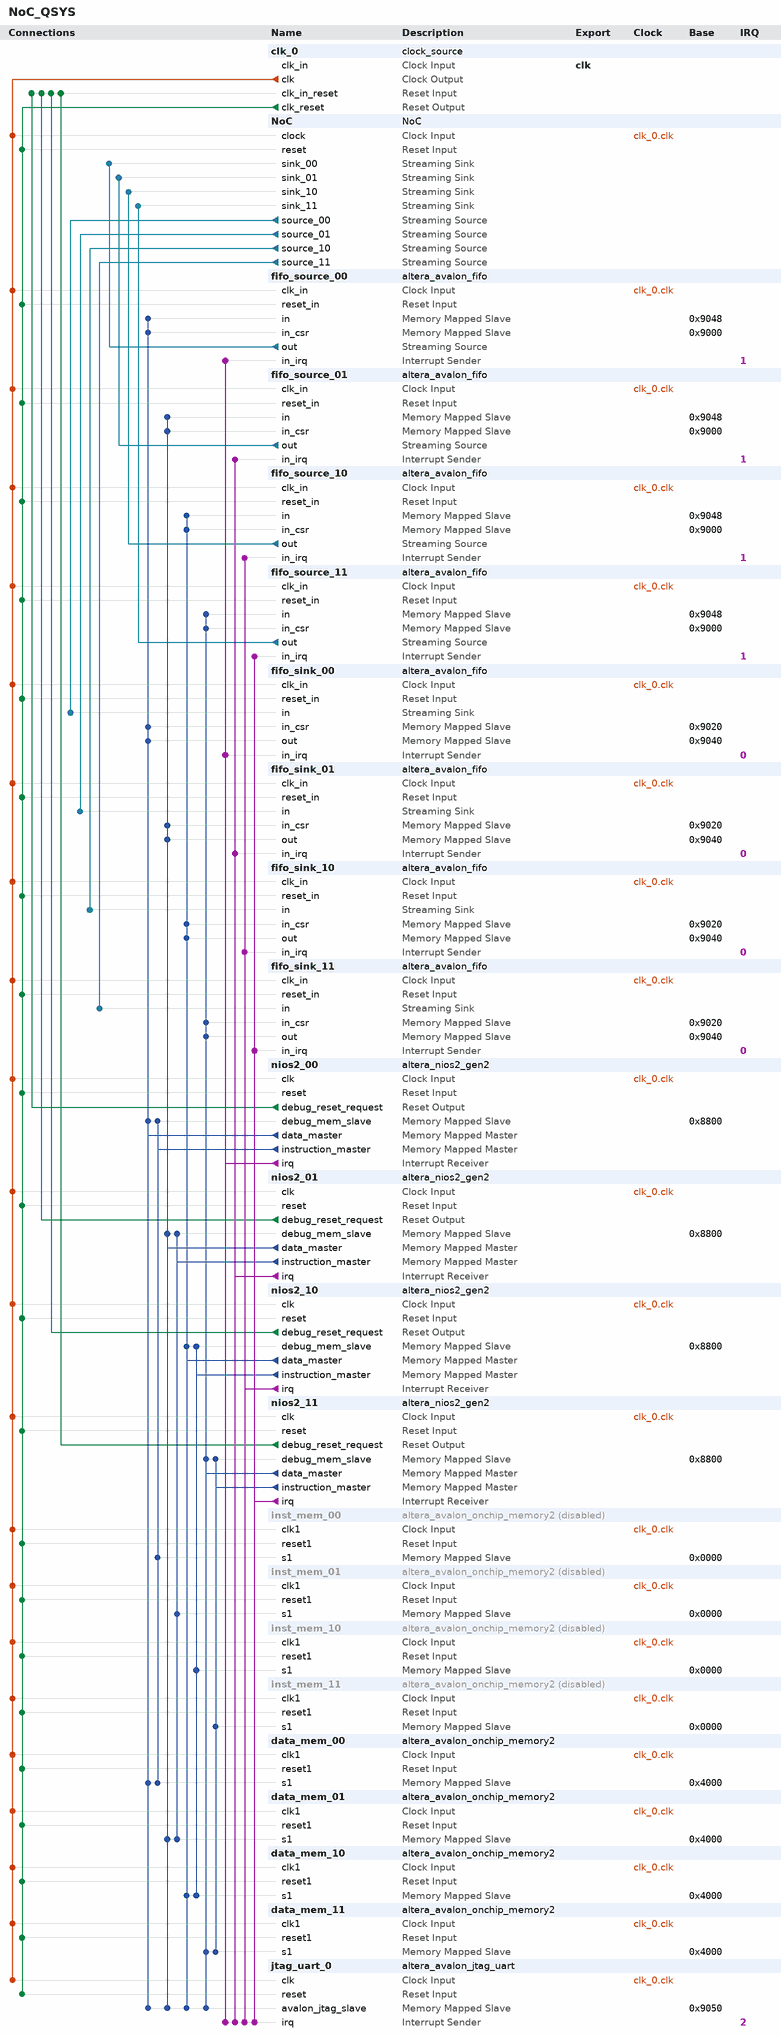
[diagram p0: system contents]
# Platform Designer (Qsys) system NoC_QSYS, Cyclone V 5CSEMA4U23C6
# Parameters at their usual value, and those the tool derives, are not listed.
package require -exact qsys 17.1
create_system NoC_QSYS
set_project_property DEVICE_FAMILY {Cyclone V}
set_project_property DEVICE 5CSEMA4U23C6

add_instance clk_0 clock_source 17.1
set_instance_parameter_value clk_0 clockFrequency 50000000

add_instance NoC NoC 1.0
set_instance_parameter_value NoC DataWidth 8
set_instance_parameter_value NoC PackWidth 8
set_instance_parameter_value NoC PhyCh 4
set_instance_parameter_value NoC PhyChAddr 2
set_instance_parameter_value NoC PhyRoCh 5
set_instance_parameter_value NoC PhyRoChAddr 3
set_instance_parameter_value NoC RoCh 1
set_instance_parameter_value NoC RoChAddr 1
set_instance_parameter_value NoC ViCh 1
set_instance_parameter_value NoC ViChAddr 1

add_instance fifo_source_00 altera_avalon_fifo 17.1
set_instance_parameter_value fifo_source_00 bitsPerSymbol 8
set_instance_parameter_value fifo_source_00 channelWidth 8
set_instance_parameter_value fifo_source_00 errorWidth 8
set_instance_parameter_value fifo_source_00 fifoDepth 16
set_instance_parameter_value fifo_source_00 fifoInputInterfaceOptions AVALONMM_WRITE
set_instance_parameter_value fifo_source_00 fifoOutputInterfaceOptions AVALONST_SOURCE
set_instance_parameter_value fifo_source_00 singleClockMode true
set_instance_parameter_value fifo_source_00 symbolsPerBeat 4
set_instance_parameter_value fifo_source_00 useIRQ true
set_instance_parameter_value fifo_source_00 usePacket false
set_instance_parameter_value fifo_source_00 useReadControl false

add_instance fifo_source_01 altera_avalon_fifo 17.1
set_instance_parameter_value fifo_source_01 bitsPerSymbol 8
set_instance_parameter_value fifo_source_01 channelWidth 8
set_instance_parameter_value fifo_source_01 errorWidth 8
set_instance_parameter_value fifo_source_01 fifoDepth 16
set_instance_parameter_value fifo_source_01 fifoInputInterfaceOptions AVALONMM_WRITE
set_instance_parameter_value fifo_source_01 fifoOutputInterfaceOptions AVALONST_SOURCE
set_instance_parameter_value fifo_source_01 singleClockMode true
set_instance_parameter_value fifo_source_01 symbolsPerBeat 4
set_instance_parameter_value fifo_source_01 useIRQ true
set_instance_parameter_value fifo_source_01 usePacket false
set_instance_parameter_value fifo_source_01 useReadControl false

add_instance fifo_source_10 altera_avalon_fifo 17.1
set_instance_parameter_value fifo_source_10 bitsPerSymbol 8
set_instance_parameter_value fifo_source_10 channelWidth 8
set_instance_parameter_value fifo_source_10 errorWidth 8
set_instance_parameter_value fifo_source_10 fifoDepth 16
set_instance_parameter_value fifo_source_10 fifoInputInterfaceOptions AVALONMM_WRITE
set_instance_parameter_value fifo_source_10 fifoOutputInterfaceOptions AVALONST_SOURCE
set_instance_parameter_value fifo_source_10 singleClockMode true
set_instance_parameter_value fifo_source_10 symbolsPerBeat 4
set_instance_parameter_value fifo_source_10 useIRQ true
set_instance_parameter_value fifo_source_10 usePacket false
set_instance_parameter_value fifo_source_10 useReadControl false

add_instance fifo_source_11 altera_avalon_fifo 17.1
set_instance_parameter_value fifo_source_11 bitsPerSymbol 8
set_instance_parameter_value fifo_source_11 channelWidth 8
set_instance_parameter_value fifo_source_11 errorWidth 8
set_instance_parameter_value fifo_source_11 fifoDepth 16
set_instance_parameter_value fifo_source_11 fifoInputInterfaceOptions AVALONMM_WRITE
set_instance_parameter_value fifo_source_11 fifoOutputInterfaceOptions AVALONST_SOURCE
set_instance_parameter_value fifo_source_11 singleClockMode true
set_instance_parameter_value fifo_source_11 symbolsPerBeat 4
set_instance_parameter_value fifo_source_11 useIRQ true
set_instance_parameter_value fifo_source_11 usePacket false
set_instance_parameter_value fifo_source_11 useReadControl false

add_instance fifo_sink_00 altera_avalon_fifo 17.1
set_instance_parameter_value fifo_sink_00 bitsPerSymbol 8
set_instance_parameter_value fifo_sink_00 channelWidth 8
set_instance_parameter_value fifo_sink_00 errorWidth 8
set_instance_parameter_value fifo_sink_00 fifoDepth 16
set_instance_parameter_value fifo_sink_00 fifoInputInterfaceOptions AVALONST_SINK
set_instance_parameter_value fifo_sink_00 fifoOutputInterfaceOptions AVALONMM_READ
set_instance_parameter_value fifo_sink_00 singleClockMode true
set_instance_parameter_value fifo_sink_00 symbolsPerBeat 4
set_instance_parameter_value fifo_sink_00 useIRQ true
set_instance_parameter_value fifo_sink_00 usePacket false
set_instance_parameter_value fifo_sink_00 useReadControl false

add_instance fifo_sink_01 altera_avalon_fifo 17.1
set_instance_parameter_value fifo_sink_01 bitsPerSymbol 8
set_instance_parameter_value fifo_sink_01 channelWidth 8
set_instance_parameter_value fifo_sink_01 errorWidth 8
set_instance_parameter_value fifo_sink_01 fifoDepth 16
set_instance_parameter_value fifo_sink_01 fifoInputInterfaceOptions AVALONST_SINK
set_instance_parameter_value fifo_sink_01 fifoOutputInterfaceOptions AVALONMM_READ
set_instance_parameter_value fifo_sink_01 singleClockMode true
set_instance_parameter_value fifo_sink_01 symbolsPerBeat 4
set_instance_parameter_value fifo_sink_01 useIRQ true
set_instance_parameter_value fifo_sink_01 usePacket false
set_instance_parameter_value fifo_sink_01 useReadControl false

add_instance fifo_sink_10 altera_avalon_fifo 17.1
set_instance_parameter_value fifo_sink_10 bitsPerSymbol 8
set_instance_parameter_value fifo_sink_10 channelWidth 8
set_instance_parameter_value fifo_sink_10 errorWidth 8
set_instance_parameter_value fifo_sink_10 fifoDepth 16
set_instance_parameter_value fifo_sink_10 fifoInputInterfaceOptions AVALONST_SINK
set_instance_parameter_value fifo_sink_10 fifoOutputInterfaceOptions AVALONMM_READ
set_instance_parameter_value fifo_sink_10 singleClockMode true
set_instance_parameter_value fifo_sink_10 symbolsPerBeat 4
set_instance_parameter_value fifo_sink_10 useIRQ true
set_instance_parameter_value fifo_sink_10 usePacket false
set_instance_parameter_value fifo_sink_10 useReadControl false

add_instance fifo_sink_11 altera_avalon_fifo 17.1
set_instance_parameter_value fifo_sink_11 bitsPerSymbol 8
set_instance_parameter_value fifo_sink_11 channelWidth 8
set_instance_parameter_value fifo_sink_11 errorWidth 8
set_instance_parameter_value fifo_sink_11 fifoDepth 16
set_instance_parameter_value fifo_sink_11 fifoInputInterfaceOptions AVALONST_SINK
set_instance_parameter_value fifo_sink_11 fifoOutputInterfaceOptions AVALONMM_READ
set_instance_parameter_value fifo_sink_11 singleClockMode true
set_instance_parameter_value fifo_sink_11 symbolsPerBeat 4
set_instance_parameter_value fifo_sink_11 useIRQ true
set_instance_parameter_value fifo_sink_11 usePacket false
set_instance_parameter_value fifo_sink_11 useReadControl false

add_instance nios2_00 altera_nios2_gen2 17.1
set_instance_parameter_value nios2_00 dcache_size 2048
set_instance_parameter_value nios2_00 exceptionSlave data_mem_00.s1
set_instance_parameter_value nios2_00 icache_size 4096
set_instance_parameter_value nios2_00 impl Tiny
set_instance_parameter_value nios2_00 resetSlave data_mem_00.s1

add_instance nios2_01 altera_nios2_gen2 17.1
set_instance_parameter_value nios2_01 dcache_size 2048
set_instance_parameter_value nios2_01 exceptionSlave data_mem_01.s1
set_instance_parameter_value nios2_01 icache_size 4096
set_instance_parameter_value nios2_01 impl Tiny
set_instance_parameter_value nios2_01 resetSlave data_mem_01.s1

add_instance nios2_10 altera_nios2_gen2 17.1
set_instance_parameter_value nios2_10 dcache_size 2048
set_instance_parameter_value nios2_10 exceptionSlave data_mem_10.s1
set_instance_parameter_value nios2_10 icache_size 4096
set_instance_parameter_value nios2_10 impl Tiny
set_instance_parameter_value nios2_10 resetSlave data_mem_10.s1

add_instance nios2_11 altera_nios2_gen2 17.1
set_instance_parameter_value nios2_11 dcache_size 2048
set_instance_parameter_value nios2_11 exceptionSlave data_mem_11.s1
set_instance_parameter_value nios2_11 icache_size 4096
set_instance_parameter_value nios2_11 impl Tiny
set_instance_parameter_value nios2_11 resetSlave data_mem_11.s1

add_instance inst_mem_00 altera_avalon_onchip_memory2 17.1
set_instance_property inst_mem_00 ENABLED false
set_instance_parameter_value inst_mem_00 dataWidth 32
set_instance_parameter_value inst_mem_00 dualPort false
set_instance_parameter_value inst_mem_00 initMemContent true
set_instance_parameter_value inst_mem_00 initializationFileName onchip_mem.hex
set_instance_parameter_value inst_mem_00 memorySize 16384

add_instance inst_mem_01 altera_avalon_onchip_memory2 17.1
set_instance_property inst_mem_01 ENABLED false
set_instance_parameter_value inst_mem_01 dataWidth 32
set_instance_parameter_value inst_mem_01 dualPort false
set_instance_parameter_value inst_mem_01 initMemContent true
set_instance_parameter_value inst_mem_01 initializationFileName onchip_mem.hex
set_instance_parameter_value inst_mem_01 memorySize 16384

add_instance inst_mem_10 altera_avalon_onchip_memory2 17.1
set_instance_property inst_mem_10 ENABLED false
set_instance_parameter_value inst_mem_10 dataWidth 32
set_instance_parameter_value inst_mem_10 dualPort false
set_instance_parameter_value inst_mem_10 initMemContent true
set_instance_parameter_value inst_mem_10 initializationFileName onchip_mem.hex
set_instance_parameter_value inst_mem_10 memorySize 16384

add_instance inst_mem_11 altera_avalon_onchip_memory2 17.1
set_instance_property inst_mem_11 ENABLED false
set_instance_parameter_value inst_mem_11 dataWidth 32
set_instance_parameter_value inst_mem_11 dualPort false
set_instance_parameter_value inst_mem_11 initMemContent true
set_instance_parameter_value inst_mem_11 initializationFileName onchip_mem.hex
set_instance_parameter_value inst_mem_11 memorySize 16384

add_instance data_mem_00 altera_avalon_onchip_memory2 17.1
set_instance_parameter_value data_mem_00 dataWidth 32
set_instance_parameter_value data_mem_00 dualPort false
set_instance_parameter_value data_mem_00 initMemContent true
set_instance_parameter_value data_mem_00 initializationFileName onchip_mem.hex
set_instance_parameter_value data_mem_00 memorySize 16384

add_instance data_mem_01 altera_avalon_onchip_memory2 17.1
set_instance_parameter_value data_mem_01 dataWidth 32
set_instance_parameter_value data_mem_01 dualPort false
set_instance_parameter_value data_mem_01 initMemContent true
set_instance_parameter_value data_mem_01 initializationFileName onchip_mem.hex
set_instance_parameter_value data_mem_01 memorySize 16384

add_instance data_mem_10 altera_avalon_onchip_memory2 17.1
set_instance_parameter_value data_mem_10 dataWidth 32
set_instance_parameter_value data_mem_10 dualPort false
set_instance_parameter_value data_mem_10 initMemContent true
set_instance_parameter_value data_mem_10 initializationFileName onchip_mem.hex
set_instance_parameter_value data_mem_10 memorySize 16384

add_instance data_mem_11 altera_avalon_onchip_memory2 17.1
set_instance_parameter_value data_mem_11 dataWidth 32
set_instance_parameter_value data_mem_11 dualPort false
set_instance_parameter_value data_mem_11 initMemContent true
set_instance_parameter_value data_mem_11 initializationFileName onchip_mem.hex
set_instance_parameter_value data_mem_11 memorySize 16384

add_instance jtag_uart_0 altera_avalon_jtag_uart 17.1
set_instance_parameter_value jtag_uart_0 simInteractiveOptions NO_INTERACTIVE_WINDOWS

# connections
add_connection clk_0.clk data_mem_00.clk1 clock
add_connection clk_0.clk data_mem_01.clk1 clock
add_connection clk_0.clk data_mem_10.clk1 clock
add_connection clk_0.clk data_mem_11.clk1 clock
add_connection clk_0.clk fifo_sink_00.clk_in clock
add_connection clk_0.clk fifo_sink_01.clk_in clock
add_connection clk_0.clk fifo_sink_10.clk_in clock
add_connection clk_0.clk fifo_sink_11.clk_in clock
add_connection clk_0.clk fifo_source_00.clk_in clock
add_connection clk_0.clk fifo_source_01.clk_in clock
add_connection clk_0.clk fifo_source_10.clk_in clock
add_connection clk_0.clk fifo_source_11.clk_in clock
add_connection clk_0.clk inst_mem_00.clk1 clock
add_connection clk_0.clk inst_mem_01.clk1 clock
add_connection clk_0.clk inst_mem_10.clk1 clock
add_connection clk_0.clk inst_mem_11.clk1 clock
add_connection clk_0.clk jtag_uart_0.clk clock
add_connection clk_0.clk nios2_00.clk clock
add_connection clk_0.clk nios2_01.clk clock
add_connection clk_0.clk nios2_10.clk clock
add_connection clk_0.clk nios2_11.clk clock
add_connection clk_0.clk NoC.clock clock
add_connection clk_0.clk_reset data_mem_00.reset1 reset
add_connection clk_0.clk_reset data_mem_01.reset1 reset
add_connection clk_0.clk_reset data_mem_10.reset1 reset
add_connection clk_0.clk_reset data_mem_11.reset1 reset
add_connection clk_0.clk_reset fifo_sink_00.reset_in reset
add_connection clk_0.clk_reset fifo_sink_01.reset_in reset
add_connection clk_0.clk_reset fifo_sink_10.reset_in reset
add_connection clk_0.clk_reset fifo_sink_11.reset_in reset
add_connection clk_0.clk_reset fifo_source_00.reset_in reset
add_connection clk_0.clk_reset fifo_source_01.reset_in reset
add_connection clk_0.clk_reset fifo_source_10.reset_in reset
add_connection clk_0.clk_reset fifo_source_11.reset_in reset
add_connection clk_0.clk_reset inst_mem_00.reset1 reset
add_connection clk_0.clk_reset inst_mem_01.reset1 reset
add_connection clk_0.clk_reset inst_mem_10.reset1 reset
add_connection clk_0.clk_reset inst_mem_11.reset1 reset
add_connection clk_0.clk_reset jtag_uart_0.reset reset
add_connection clk_0.clk_reset nios2_00.reset reset
add_connection clk_0.clk_reset nios2_01.reset reset
add_connection clk_0.clk_reset nios2_10.reset reset
add_connection clk_0.clk_reset nios2_11.reset reset
add_connection clk_0.clk_reset NoC.reset reset
add_connection nios2_00.debug_reset_request clk_0.clk_in_reset reset
add_connection nios2_01.debug_reset_request clk_0.clk_in_reset reset
add_connection nios2_10.debug_reset_request clk_0.clk_in_reset reset
add_connection nios2_11.debug_reset_request clk_0.clk_in_reset reset
add_connection nios2_00.data_master data_mem_00.s1 avalon
set_connection_parameter_value nios2_00.data_master/data_mem_00.s1 baseAddress 0x4000
add_connection nios2_00.data_master fifo_sink_00.in_csr avalon
set_connection_parameter_value nios2_00.data_master/fifo_sink_00.in_csr baseAddress 0x9020
add_connection nios2_00.data_master fifo_sink_00.out avalon
set_connection_parameter_value nios2_00.data_master/fifo_sink_00.out baseAddress 0x9040
add_connection nios2_00.data_master fifo_source_00.in avalon
set_connection_parameter_value nios2_00.data_master/fifo_source_00.in baseAddress 0x9048
add_connection nios2_00.data_master fifo_source_00.in_csr avalon
set_connection_parameter_value nios2_00.data_master/fifo_source_00.in_csr baseAddress 0x9000
add_connection nios2_00.data_master jtag_uart_0.avalon_jtag_slave avalon
set_connection_parameter_value nios2_00.data_master/jtag_uart_0.avalon_jtag_slave baseAddress 0x9050
add_connection nios2_00.data_master nios2_00.debug_mem_slave avalon
set_connection_parameter_value nios2_00.data_master/nios2_00.debug_mem_slave baseAddress 0x8800
add_connection nios2_00.instruction_master data_mem_00.s1 avalon
set_connection_parameter_value nios2_00.instruction_master/data_mem_00.s1 baseAddress 0x4000
add_connection nios2_00.instruction_master inst_mem_00.s1 avalon
set_connection_parameter_value nios2_00.instruction_master/inst_mem_00.s1 baseAddress 0x0000
add_connection nios2_00.instruction_master nios2_00.debug_mem_slave avalon
set_connection_parameter_value nios2_00.instruction_master/nios2_00.debug_mem_slave baseAddress 0x8800
add_connection nios2_01.data_master data_mem_01.s1 avalon
set_connection_parameter_value nios2_01.data_master/data_mem_01.s1 baseAddress 0x4000
add_connection nios2_01.data_master fifo_sink_01.in_csr avalon
set_connection_parameter_value nios2_01.data_master/fifo_sink_01.in_csr baseAddress 0x9020
add_connection nios2_01.data_master fifo_sink_01.out avalon
set_connection_parameter_value nios2_01.data_master/fifo_sink_01.out baseAddress 0x9040
add_connection nios2_01.data_master fifo_source_01.in avalon
set_connection_parameter_value nios2_01.data_master/fifo_source_01.in baseAddress 0x9048
add_connection nios2_01.data_master fifo_source_01.in_csr avalon
set_connection_parameter_value nios2_01.data_master/fifo_source_01.in_csr baseAddress 0x9000
add_connection nios2_01.data_master jtag_uart_0.avalon_jtag_slave avalon
set_connection_parameter_value nios2_01.data_master/jtag_uart_0.avalon_jtag_slave baseAddress 0x9050
add_connection nios2_01.data_master nios2_01.debug_mem_slave avalon
set_connection_parameter_value nios2_01.data_master/nios2_01.debug_mem_slave baseAddress 0x8800
add_connection nios2_01.instruction_master data_mem_01.s1 avalon
set_connection_parameter_value nios2_01.instruction_master/data_mem_01.s1 baseAddress 0x4000
add_connection nios2_01.instruction_master inst_mem_01.s1 avalon
set_connection_parameter_value nios2_01.instruction_master/inst_mem_01.s1 baseAddress 0x0000
add_connection nios2_01.instruction_master nios2_01.debug_mem_slave avalon
set_connection_parameter_value nios2_01.instruction_master/nios2_01.debug_mem_slave baseAddress 0x8800
add_connection nios2_10.data_master data_mem_10.s1 avalon
set_connection_parameter_value nios2_10.data_master/data_mem_10.s1 baseAddress 0x4000
add_connection nios2_10.data_master fifo_sink_10.in_csr avalon
set_connection_parameter_value nios2_10.data_master/fifo_sink_10.in_csr baseAddress 0x9020
add_connection nios2_10.data_master fifo_sink_10.out avalon
set_connection_parameter_value nios2_10.data_master/fifo_sink_10.out baseAddress 0x9040
add_connection nios2_10.data_master fifo_source_10.in avalon
set_connection_parameter_value nios2_10.data_master/fifo_source_10.in baseAddress 0x9048
add_connection nios2_10.data_master fifo_source_10.in_csr avalon
set_connection_parameter_value nios2_10.data_master/fifo_source_10.in_csr baseAddress 0x9000
add_connection nios2_10.data_master jtag_uart_0.avalon_jtag_slave avalon
set_connection_parameter_value nios2_10.data_master/jtag_uart_0.avalon_jtag_slave baseAddress 0x9050
add_connection nios2_10.data_master nios2_10.debug_mem_slave avalon
set_connection_parameter_value nios2_10.data_master/nios2_10.debug_mem_slave baseAddress 0x8800
add_connection nios2_10.instruction_master data_mem_10.s1 avalon
set_connection_parameter_value nios2_10.instruction_master/data_mem_10.s1 baseAddress 0x4000
add_connection nios2_10.instruction_master inst_mem_10.s1 avalon
set_connection_parameter_value nios2_10.instruction_master/inst_mem_10.s1 baseAddress 0x0000
add_connection nios2_10.instruction_master nios2_10.debug_mem_slave avalon
set_connection_parameter_value nios2_10.instruction_master/nios2_10.debug_mem_slave baseAddress 0x8800
add_connection nios2_11.data_master data_mem_11.s1 avalon
set_connection_parameter_value nios2_11.data_master/data_mem_11.s1 baseAddress 0x4000
add_connection nios2_11.data_master fifo_sink_11.in_csr avalon
set_connection_parameter_value nios2_11.data_master/fifo_sink_11.in_csr baseAddress 0x9020
add_connection nios2_11.data_master fifo_sink_11.out avalon
set_connection_parameter_value nios2_11.data_master/fifo_sink_11.out baseAddress 0x9040
add_connection nios2_11.data_master fifo_source_11.in avalon
set_connection_parameter_value nios2_11.data_master/fifo_source_11.in baseAddress 0x9048
add_connection nios2_11.data_master fifo_source_11.in_csr avalon
set_connection_parameter_value nios2_11.data_master/fifo_source_11.in_csr baseAddress 0x9000
add_connection nios2_11.data_master jtag_uart_0.avalon_jtag_slave avalon
set_connection_parameter_value nios2_11.data_master/jtag_uart_0.avalon_jtag_slave baseAddress 0x9050
add_connection nios2_11.data_master nios2_11.debug_mem_slave avalon
set_connection_parameter_value nios2_11.data_master/nios2_11.debug_mem_slave baseAddress 0x8800
add_connection nios2_11.instruction_master data_mem_11.s1 avalon
set_connection_parameter_value nios2_11.instruction_master/data_mem_11.s1 baseAddress 0x4000
add_connection nios2_11.instruction_master inst_mem_11.s1 avalon
set_connection_parameter_value nios2_11.instruction_master/inst_mem_11.s1 baseAddress 0x0000
add_connection nios2_11.instruction_master nios2_11.debug_mem_slave avalon
set_connection_parameter_value nios2_11.instruction_master/nios2_11.debug_mem_slave baseAddress 0x8800
add_connection fifo_source_00.out NoC.sink_00 avalon_streaming
add_connection fifo_source_01.out NoC.sink_01 avalon_streaming
add_connection fifo_source_10.out NoC.sink_10 avalon_streaming
add_connection fifo_source_11.out NoC.sink_11 avalon_streaming
add_connection NoC.source_00 fifo_sink_00.in avalon_streaming
add_connection NoC.source_01 fifo_sink_01.in avalon_streaming
add_connection NoC.source_10 fifo_sink_10.in avalon_streaming
add_connection NoC.source_11 fifo_sink_11.in avalon_streaming
add_connection nios2_00.irq fifo_sink_00.in_irq interrupt
set_connection_parameter_value nios2_00.irq/fifo_sink_00.in_irq irqNumber 0
add_connection nios2_00.irq fifo_source_00.in_irq interrupt
set_connection_parameter_value nios2_00.irq/fifo_source_00.in_irq irqNumber 1
add_connection nios2_00.irq jtag_uart_0.irq interrupt
set_connection_parameter_value nios2_00.irq/jtag_uart_0.irq irqNumber 2
add_connection nios2_01.irq fifo_sink_01.in_irq interrupt
set_connection_parameter_value nios2_01.irq/fifo_sink_01.in_irq irqNumber 0
add_connection nios2_01.irq fifo_source_01.in_irq interrupt
set_connection_parameter_value nios2_01.irq/fifo_source_01.in_irq irqNumber 1
add_connection nios2_01.irq jtag_uart_0.irq interrupt
set_connection_parameter_value nios2_01.irq/jtag_uart_0.irq irqNumber 2
add_connection nios2_10.irq fifo_sink_10.in_irq interrupt
set_connection_parameter_value nios2_10.irq/fifo_sink_10.in_irq irqNumber 0
add_connection nios2_10.irq fifo_source_10.in_irq interrupt
set_connection_parameter_value nios2_10.irq/fifo_source_10.in_irq irqNumber 1
add_connection nios2_10.irq jtag_uart_0.irq interrupt
set_connection_parameter_value nios2_10.irq/jtag_uart_0.irq irqNumber 2
add_connection nios2_11.irq fifo_sink_11.in_irq interrupt
set_connection_parameter_value nios2_11.irq/fifo_sink_11.in_irq irqNumber 0
add_connection nios2_11.irq fifo_source_11.in_irq interrupt
set_connection_parameter_value nios2_11.irq/fifo_source_11.in_irq irqNumber 1
add_connection nios2_11.irq jtag_uart_0.irq interrupt
set_connection_parameter_value nios2_11.irq/jtag_uart_0.irq irqNumber 2

# exported interfaces
add_interface clk clock sink
set_interface_property clk EXPORT_OF clk_0.clk_in

set_interconnect_requirement {$system} qsys_mm.clockCrossingAdapter HANDSHAKE
set_interconnect_requirement {$system} qsys_mm.enableEccProtection FALSE
set_interconnect_requirement {$system} qsys_mm.insertDefaultSlave FALSE
set_interconnect_requirement {$system} qsys_mm.maxAdditionalLatency 1

save_system NoC_QSYS.qsys
